# Altium project IMU_ATM_Module.PrjPcb
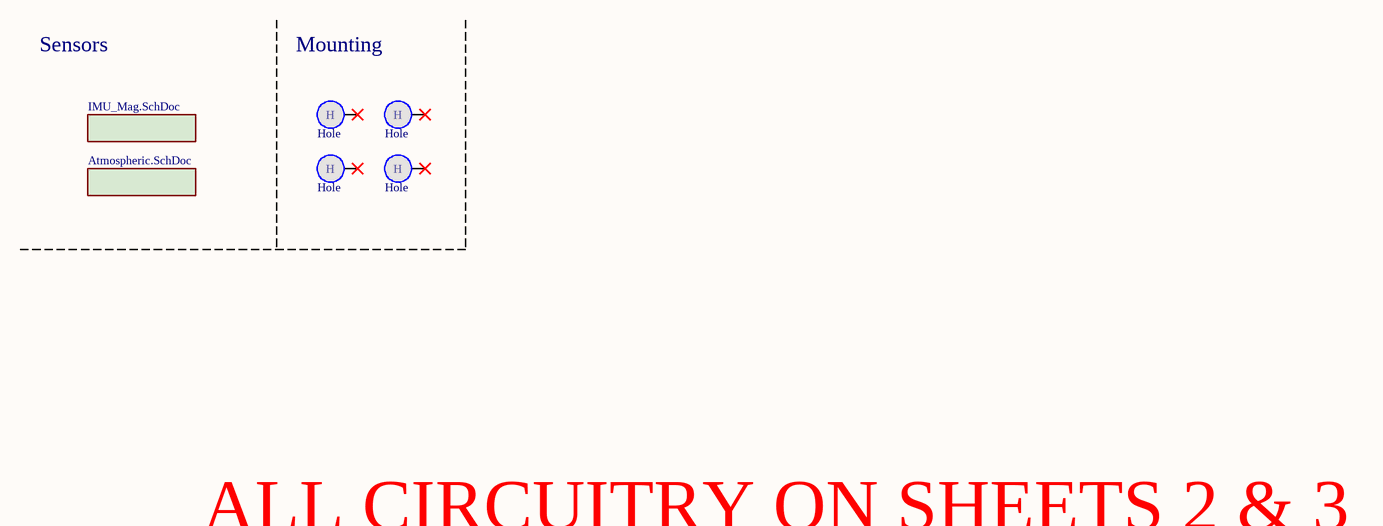
[diagram p0: IMU_ATM_Module.SchDoc]
MainProjectName: The ROS Robot Project
2 sheets, 26 parts. Net scope: global (net labels, ports and power ports of the same name join across sheets).
Board file: IMU_ATM_Module.PcbDoc
Sheets:
  IMU_ATM_Module.SchDoc
    IMU_SENS = IMU_Mag.SchDoc

## Sheet IMU_ATM_Module.SchDoc: IMU/Atm. Sensor Module
size A4; DrawnBy: Samyar Sadat Akhavi; Revision: 1.0; SheetNumber: 1; SheetTotal: 3

### Parts
(Parts that share a designator on the sheet are numbered #1, #2 ... from top to bottom, then left to right.)
?#1  (no value)  (graphical)
Hole1  Hole  [Hole_2mm]  (no BOM)
Hole2  Hole  [Hole_2mm]  (no BOM)
Hole3  Hole  [Hole_2mm]  (no BOM)
Hole4  Hole  [Hole_2mm]  (no BOM)

### Sub-sheets
ATM_SENS = Atmospheric.SchDoc (file not in this document): no entries
IMU_SENS = IMU_Mag.SchDoc: no entries

### Nets

Not connected (* = marked no-connect by the designer): Hole1 1*; Hole2 1*; Hole3 1*; Hole4 1*

### Notes on the sheet
- Sensors
- Mounting
- ALL CIRCUITRY ON SHEETS 2 & 3
- Sub-Project:
- Size:
- Drawn By:
- Revision:
- Date:
- File:
- Sheet:
- of
- (in symbol Hole) H

### Library data of the parts
?#1 = Standard Title Block

## Sheet IMU_Mag.SchDoc: IMU & Magnetometer
size A4; DrawnBy: Samyar Sadat Akhavi; Revision: 1.0; SheetNumber: 2; SheetTotal: 3
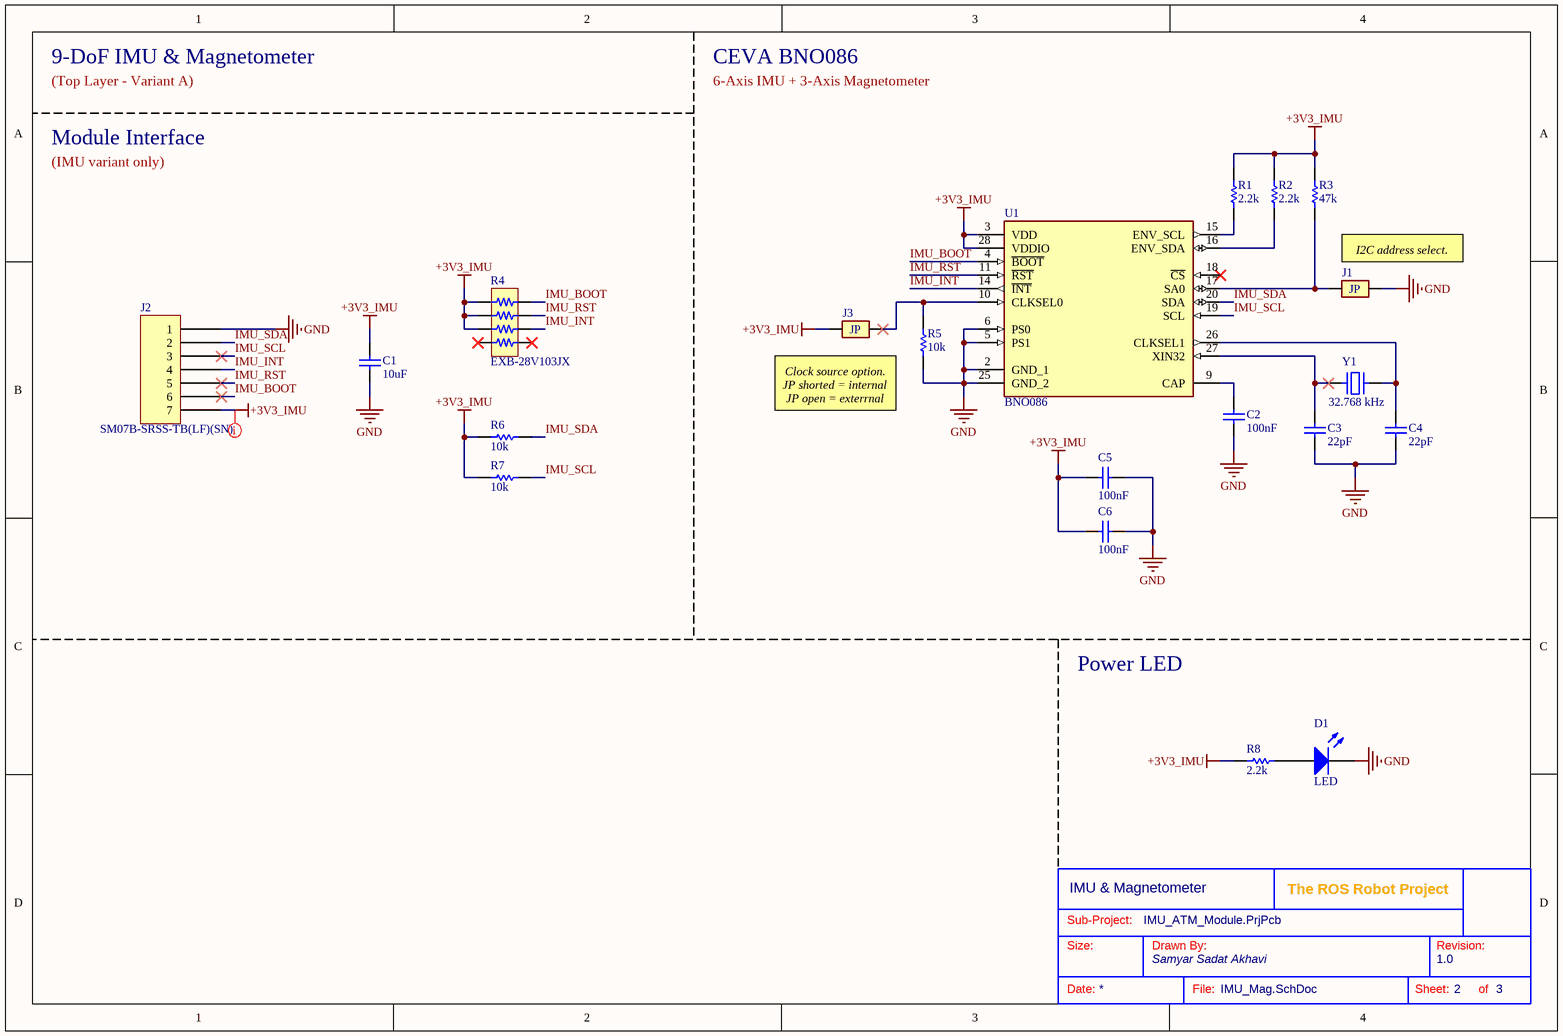
[diagram p1: IMU_Mag.SchDoc]

### Parts
(Parts that share a designator on the sheet are numbered #1, #2 ... from top to bottom, then left to right.)
?#2  (no value)  (graphical)
C1  10uF  [CAP_SMD_603]
C2  100nF  [CAP_SMD_603]
C3  22pF  [CAP_SMD_603]
C4  22pF  [CAP_SMD_603]
C5  100nF  [CAP_SMD_603]
C6  100nF  [CAP_SMD_603]
D1  LED  [LED 0805_2012 RED]
J1  Jumper Pad  [Jumper Pad]  (value not drawn)  (no BOM)
J2  SM07B-SRSS-TB(LF)(SN)  [JST SM07B-SRSS-TB]
J3  Jumper Pad  [Jumper Pad]  (value not drawn)  (no BOM)
R1  2.2k  [RES_0603]
R2  2.2k  [RES_0603]
R3  47k  [RES_0603]
R4  EXB-28V103JX  [RESNET 0804-8 CONVEX]
R5  10k  [RES_0603]
R6  10k  [RES_0603]
R7  10k  [RES_0603]
R8  2.2k  [RES_0603]
U1  BNO086  [BNO086]
Y1  32.768 kHz  [MICRO CRYSTAL CM8V H0.6mm]

### Nets
+3V3_IMU: C1.2 C5.2 C6.1 J2.7 J3.1 R1.1 R2.2 R3.1 R4.5 R4.6 R4.7 R6.1 R7.1 R8.1 U1.3(VDD) U1.28(VDDIO)
GND: C1.1 C2.1 C3.1 C4.1 C5.1 C6.2 D1.2(K) J1.2 J2.1 R5.1 U1.2(GND_1) U1.5(PS1) U1.6(PS0) U1.25(GND_2)
IMU_BOOT: J2.6 R4.4 U1.4(~{BOOT})
IMU_INT: J2.4 R4.2 U1.14(~{INT})
IMU_RST: J2.5 R4.3 U1.11(~{RST})
IMU_SCL: J2.3 R7.2 U1.19(SCL)
IMU_SDA: J2.2 R6.2 U1.20(SDA)
NetC2_2: C2.2 U1.9(CAP)
NetC3_2: C3.2 U1.27(XIN32) Y1.2
NetC4_2: C4.2 U1.26(CLKSEL1) Y1.1
NetD1_1: D1.1(A) R8.2
NetJ1_1: J1.1 R3.2 U1.17(SA0)
NetJ3_2: J3.2 R5.2 U1.10(CLKSEL0)
NetR1_2: R1.2 U1.15(ENV_SCL)
NetR2_1: R2.1 U1.16(ENV_SDA)

Not connected (* = marked no-connect by the designer): R4 1* 8*; U1 18(~{CS})*

### Layout directives
rule Supply Nets [Voltage = 3.300]: +3V3_IMU

### Notes on the sheet
- 9-DoF IMU & Magnetometer
- (Top Layer - Variant A)
- CEVA BNO086
- 6-Axis IMU + 3-Axis Magnetometer
- Module Interface
- (IMU variant only)
- I2C address select.
- Clock source option.
  JP shorted = internal
  JP open = exterrnal
- Power LED
- Sub-Project:
- Size:
- Drawn By:
- Revision:
- Date:
- File:
- Sheet:
- of
- (in symbol Jumper Pad) JP

### Library data of the parts
?#2 = Standard Title Block
C1 C5 C6 = Non-polar Capacitor: Generic Ceramic Capacitor; Voltage: 6.3V
  C1: Value: 10uF
  C5 C6: Value: 100nF
C2-C4 = Non-polar Capacitor: Generic Ceramic Capacitor; Voltage: 16V
  C2: Value: 100nF
  C3 C4: Value: 22pF
D1 = LED: Indicator LED; Color: Red
J2 = SM07B-SRSS-TB(LF)(SN): CONN HEADER SMD R/A 7POS 1MM; Manufacturer: JST Sales America Inc.; Current Rating (Amps): 0.7A; Material Flammability Rating: UL94 V-0; Number of Positions: 7; Number of Positions Loaded: All; Pitch - Mating: 0.039" (1.00mm); Shrouding: Shrouded - 4 Wall; Style: Board to Cable/Wire; Voltage Rating: 50V; Part Number: SM07B-SRSS-TB(LF)(SN); ComponentLink1Description: Datasheet; ComponentLink1URL: http://www.jst-mfg.com/product/pdf/eng/eSH.pdf; ComponentLink2Description: DigiKey Link; ComponentLink2URL: http://digikey.com/product-detail/en/jst-sales-america-inc/SM07B-SRSS-TB-LF-SN/455-1807-1-ND/926878; Connector Type: Header; Contact Finish - Mating: Tin; Contact Finish - Post: Tin; Contact Material: Copper Alloy; Contact Shape: Square; Contact Type: Male Pin; Fastening Type: Push-Pull; Features: Solder Retention; Insulation Color: Natural; Insulation Height: 0.114" (2.90mm); Insulation Material: Polyamide (PA), Nylon; LastUpdated: 1/12/2020 11:42:26 PM; Lifecycle Status: Active; Minimum Order: 1; Mounting Type: Surface Mount, Right Angle; Number of Rows: 1; Operating Temperature: -25°C ~ 85°C; Packaging: TapeAndReel; PartId: 65; Part Status: Active; Price: 0.39; Series: SR; Supplier 1: DigiKey; Supplier Part Number 1: 455-1807-1-ND; Termination: Solder
R1-R3 R5-R8 = Resistor: Generic Resistor; Power: 1/8W
  R1 R2 R8: Value: 2.2k
  R3: Value: 47k
  R5-R7: Value: 10k
R4 = EXB-28V103JX: RES ARRAY 4 RES 10K OHM 0804; Manufacturer: Panasonic Electronic Components; Circuit Type: Isolated; Number of Resistors: 4; Power Per Element: 62.5mW; Temperature Coefficient: ±200ppm/°C; Tolerance: ±5%; Part Number: EXB-28V103JX; Applications: Automotive AEC-Q200; ComponentLink1Description: Datasheet; ComponentLink1URL: https://industrial.panasonic.com/cdbs/www-data/pdf/AOC0000/AOC0000C14.pdf; ComponentLink2Description: DigiKey Link; ComponentLink2URL: https://www.digikey.com/en/products/detail/panasonic-electronic-components/EXB-28V103JX/256299; Height - Seated (Max): 0.018" (0.45mm); LastUpdated: 6/3/2024 8:05:56 PM; Lifecycle Status: Active; Minimum Order: 1; Mounting Type: Surface Mount; Number of Pins: 8; Operating Temperature: -55°C ~ 125°C; Package / Case: 0804, Convex, Long Side Terminals; Packaging: TapeAndReel; PartId: 461; Part Status: Active; Price: 0.01; Resistance (Ohms): 10k; Series: EXB; Size / Dimension: 0.079" L x 0.039" W (2.00mm x 1.00mm); Supplier 1: DigiKey; Supplier Part Number 1: Y7103CT-ND; Supplier Device Package: 0804
U1 = BNO086: 9-axis IMU; Manufacturer_Name: CEVA; Datasheet Link: https://www.mouser.com/ProductDetail/CEVA/BNO086?qs=ulEaXIWI0c%2FqTo1scjodAw%3D%3D; Height: 1.18mm; Manufacturer_Part_Number: BNO086; Mouser Part Number: 526-BNO086; Mouser Price/Stock: https://www.mouser.co.uk/ProductDetail/CEVA/BNO086?qs=ulEaXIWI0c%2FqTo1scjodAw%3D%3D
Y1 = CM8V-T1A-32.768KHZ-12.5PF-20PPM-TA-QC: CRYSTAL 32.7680KHZ 12.5PF SMD; Manufacturer: Micro Crystal AG; ESR (Equivalent Series Resistance): 70 kOhms; Frequency Tolerance: ±20ppm; Operating Mode: Fundamental; Part Number: CM8V-T1A-32.768KHZ-12.5PF-20PPM-TA-QC; ComponentLink1Description: Datasheet; ComponentLink1URL: https://www.microcrystal.com/fileadmin/Media/Products/32kHz/Datasheet/CM8V-T1A.pdf; ComponentLink2Description: DigiKey Link; ComponentLink2URL: https://www.digikey.com/en/products/detail/micro-crystal-ag/CM8V-T1A-32-768KHZ-12-5PF-20PPM-TA-QC/10431068; Frequency: 32.768 kHz; Height - Seated (Max): 0.024" (0.60mm); LastUpdated: 6/3/2024 8:26:30 PM; Lifecycle Status: Active; Load Capacitance: 12.5pF; Minimum Order: 1; Mounting Type: Surface Mount; Operating Temperature: -40°C ~ 85°C; Package / Case: 2-SMD, No Lead; Packaging: TapeAndReel; PartId: 841; Part Status: Active; Price: 0.28; Series: CM8V; Size / Dimension: 0.079" L x 0.047" W (2.00mm x 1.20mm); Supplier 1: DigiKey; Supplier Part Number 1: 2195-CM8V-T1A-32.768KHZ-12.5PF-20PPM-TA-QCCT-ND; Type: kHz Crystal (Tuning Fork); Value: 32.768 kHz

## Assembly variants
IMU_Module: not fitted C7 C8 C9 C10 C11 D2 IC1 IC2 J4 J5 J6 R9 R10 R11 R12 R13 R14
Atmospheric_Module: not fitted C1 C2 C3 C4 C5 C6 D1 J1 J2 J3 R1 R2 R3 R4 R5 R6 R7 R8 U1 Y1